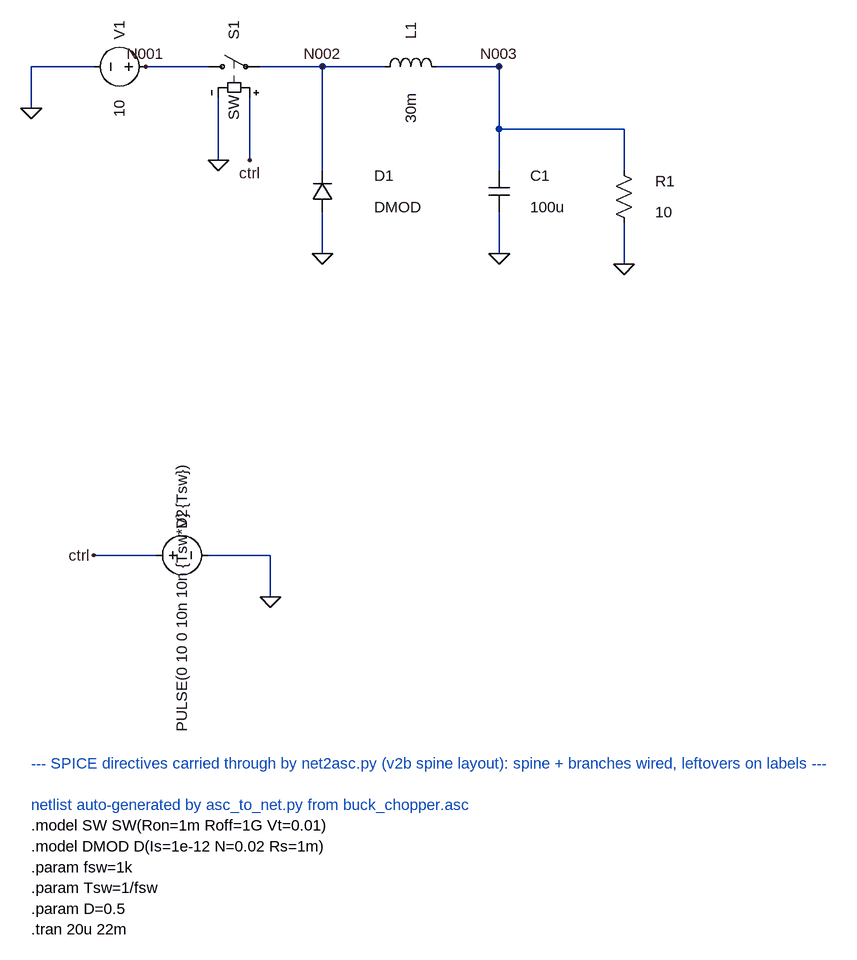
[diagram p0: schematic buck_chopper.asc]
buck_chopper.asc, the LTspice schematic file:
Version 4
SHEET 1 2080 1648
WIRE 64 128 64 192
WIRE 64 128 160 128
WIRE 240 128 336 128
WIRE 400 176 400 272
WIRE 352 176 352 272
WIRE 416 128 512 128
WIRE 512 128 608 128
WIRE 688 128 784 128
WIRE 512 128 512 224
WIRE 512 224 512 288
WIRE 512 352 512 416
WIRE 784 128 784 224
WIRE 784 224 784 288
WIRE 784 352 784 416
WIRE 784 128 784 224
WIRE 784 224 976 224
WIRE 976 224 976 288
WIRE 976 368 976 432
WIRE 160 880 256 880
WIRE 336 880 432 880
WIRE 432 880 432 944
FLAG 64 192 0
FLAG 400 272 ctrl
FLAG 352 272 0
FLAG 512 128 N002
FLAG 784 128 N003
FLAG 512 416 0
FLAG 784 416 0
FLAG 976 432 0
FLAG 160 880 ctrl
FLAG 432 944 0
FLAG 240 128 N001
SYMBOL voltage 256 128 R90
WINDOW 0 -56 56 Center 2
WINDOW 3 64 56 Center 2
SYMATTR InstName V1
SYMATTR Value 10
SYMBOL sw 320 128 R270
WINDOW 0 56 56 Center 2
WINDOW 3 -64 56 Center 2
SYMATTR InstName S1
SYMATTR Value SW
SYMBOL ind 592 144 R270
WINDOW 0 72 56 Center 2
WINDOW 3 -48 56 Center 2
SYMATTR InstName L1
SYMATTR Value 30m
SYMBOL diode 528 352 R180
WINDOW 0 -64 56 Right 2
WINDOW 3 -64 8 Right 2
SYMATTR InstName D1
SYMATTR Value DMOD
SYMBOL cap 768 288 R0
WINDOW 0 64 8 Left 2
WINDOW 3 64 56 Left 2
SYMATTR InstName C1
SYMATTR Value 100u
SYMBOL res 960 272 R0
WINDOW 0 64 32 Left 2
WINDOW 3 64 80 Left 2
SYMATTR InstName R1
SYMATTR Value 10
SYMBOL voltage 240 880 R270
WINDOW 0 56 56 Center 2
WINDOW 3 -64 56 Center 2
SYMATTR InstName V2
SYMATTR Value PULSE(0 10 0 10n 10n {Tsw*D} {Tsw})
TEXT 64 1200 Left 2 ;--- SPICE directives carried through by net2asc.py (v2b spine layout): spine + branches wired, leftovers on labels ---
TEXT 64 1264 Left 2 ;netlist auto-generated by asc_to_net.py from buck_chopper.asc
TEXT 64 1296 Left 2 !.model SW SW(Ron=1m Roff=1G Vt=0.01)
TEXT 64 1328 Left 2 !.model DMOD D(Is=1e-12 N=0.02 Rs=1m)
TEXT 64 1360 Left 2 !.param fsw=1k
TEXT 64 1392 Left 2 !.param Tsw=1/fsw
TEXT 64 1424 Left 2 !.param D=0.5
TEXT 64 1456 Left 2 !.tran 20u 22m

The netlist it stands for:
* buck_chopper.asc
V1 N001 0 10
S1 N001 N002 ctrl 0 SW
L1 N002 N003 30m
D1 0 N002 DMOD
C1 N003 0 100u
R1 N003 0 10
V2 ctrl 0 PULSE(0 10 0 10n 10n {Tsw*D} {Tsw})
.model D D
.lib standard.dio
* --- SPICE directives carried through by net2asc.py (v2b spine layout): spine + branches wired, leftovers on labels ---
* netlist auto-generated by asc_to_net.py from buck_chopper.asc
.model SW SW(Ron=1m Roff=1G Vt=0.01)
.model DMOD D(Is=1e-12 N=0.02 Rs=1m)
.param fsw=1k
.param Tsw=1/fsw
.param D=0.5
.tran 20u 22m
.backanno
.end